# Altium schematic sheet restador.SchDoc
size A4
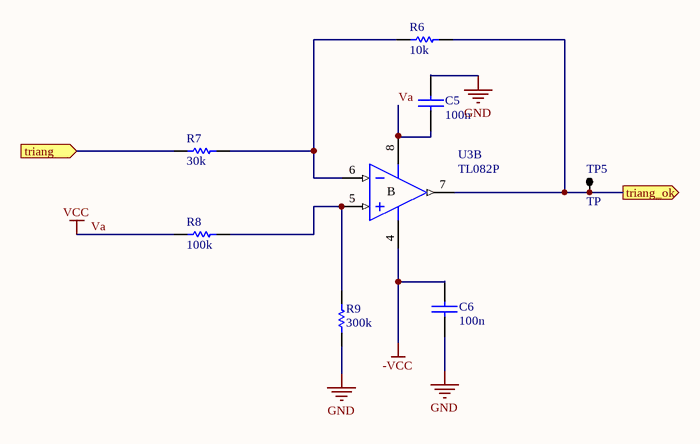
[diagram p0: restador.SchDoc]

## Parts
C5  100n  [0805]
C6  100n  [0805]
R6  10k  [0805]
R7  30k  [0805]
R8  100k  [0805]
R9  300k  [0805]
TP5  TP  [TPTH]
U3  TL082P  [P008]  (part B of 2)

## Ports
triang (in), triang_ok (out)

## Nets
-VCC: C6.1 U3.4(V-)
GND: C5.1 C6.2 R9.1
Va: C5.2 R8.1 U3.8(V+)  [also labelled VCC]
triang: R7.1 ; port triang
triang_ok: R6.2 TP5.1 U3.7(OUT) ; port triang_ok
NetR6_1: R6.1 R7.2 U3.6(IN-)
NetR8_2: R8.2 R9.2 U3.5(IN+)

## Notes on the sheet
- (in symbol TL082P, part B) B

## Library data of the parts
C5 C6 = CAP
R6-R9 = RES
U3 = TL082P: JFET-Input Operational Amplifier; Published: 16-Jan-2001; LatestRevisionDate: 04-Mar-2005; LatestRevisionNote: Stylized 3D Model Added.; DatasheetVersion: Feb-1999; PackageVersion: Jun-1999; PackageReference: P008; Publisher: Altium Limited; PackageDescription: DIP; 8 Leads; Row Spacing 7.62 mm; Pitch 2.54 mm; Code_JEDEC: MO-001-AN; ComponentLink1Description: Manufacturer Link; ComponentLink1URL: http://www.ti.com/; ComponentLink2Description: Datasheet; ComponentLink2URL: http://www-s.ti.com/sc/ds/tl082.pdf